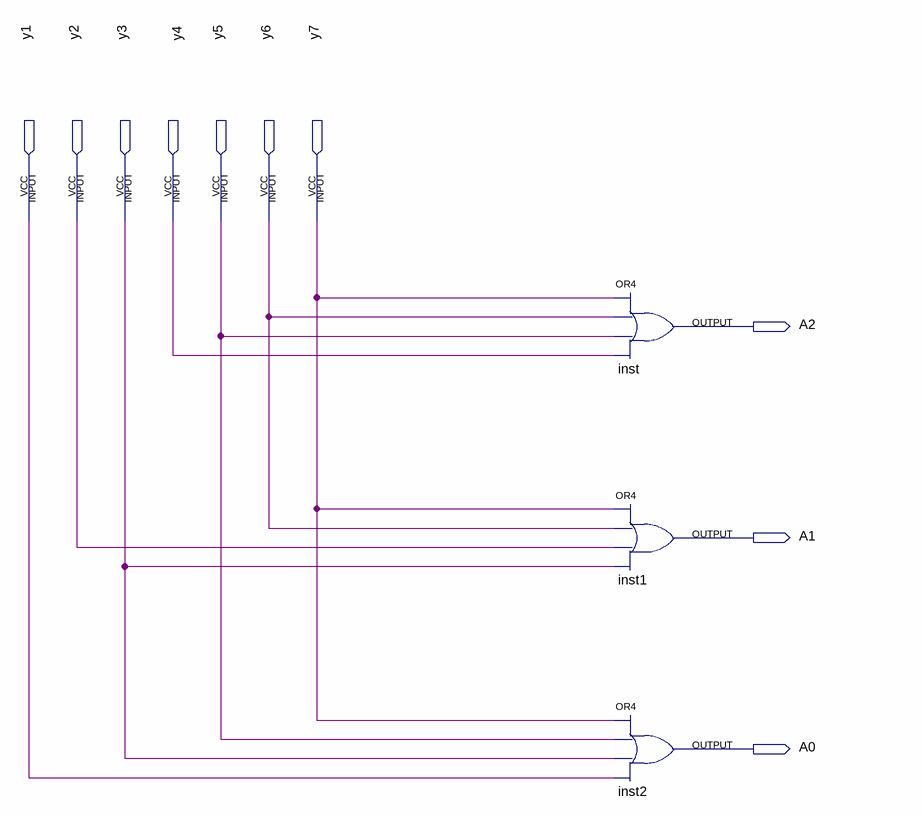
[diagram p0: schematic sheet]
// Quartus schematic EncoderDemo.bdf as structural Verilog: 3 symbols, 10 pins
module EncoderDemo (
  input  y1,
  input  y2,
  input  y3,
  input  y4,
  input  y5,
  input  y6,
  input  y7,
  output A2,
  output A1,
  output A0
);

  or inst (A2, y7, y6, y5, y4);
  or inst1 (A1, y7, y6, y2, y3);
  or inst2 (A0, y7, y5, y3, y1);
endmodule
